# Altium project Slit_Lamp.PrjPcb (part 1 of 2)
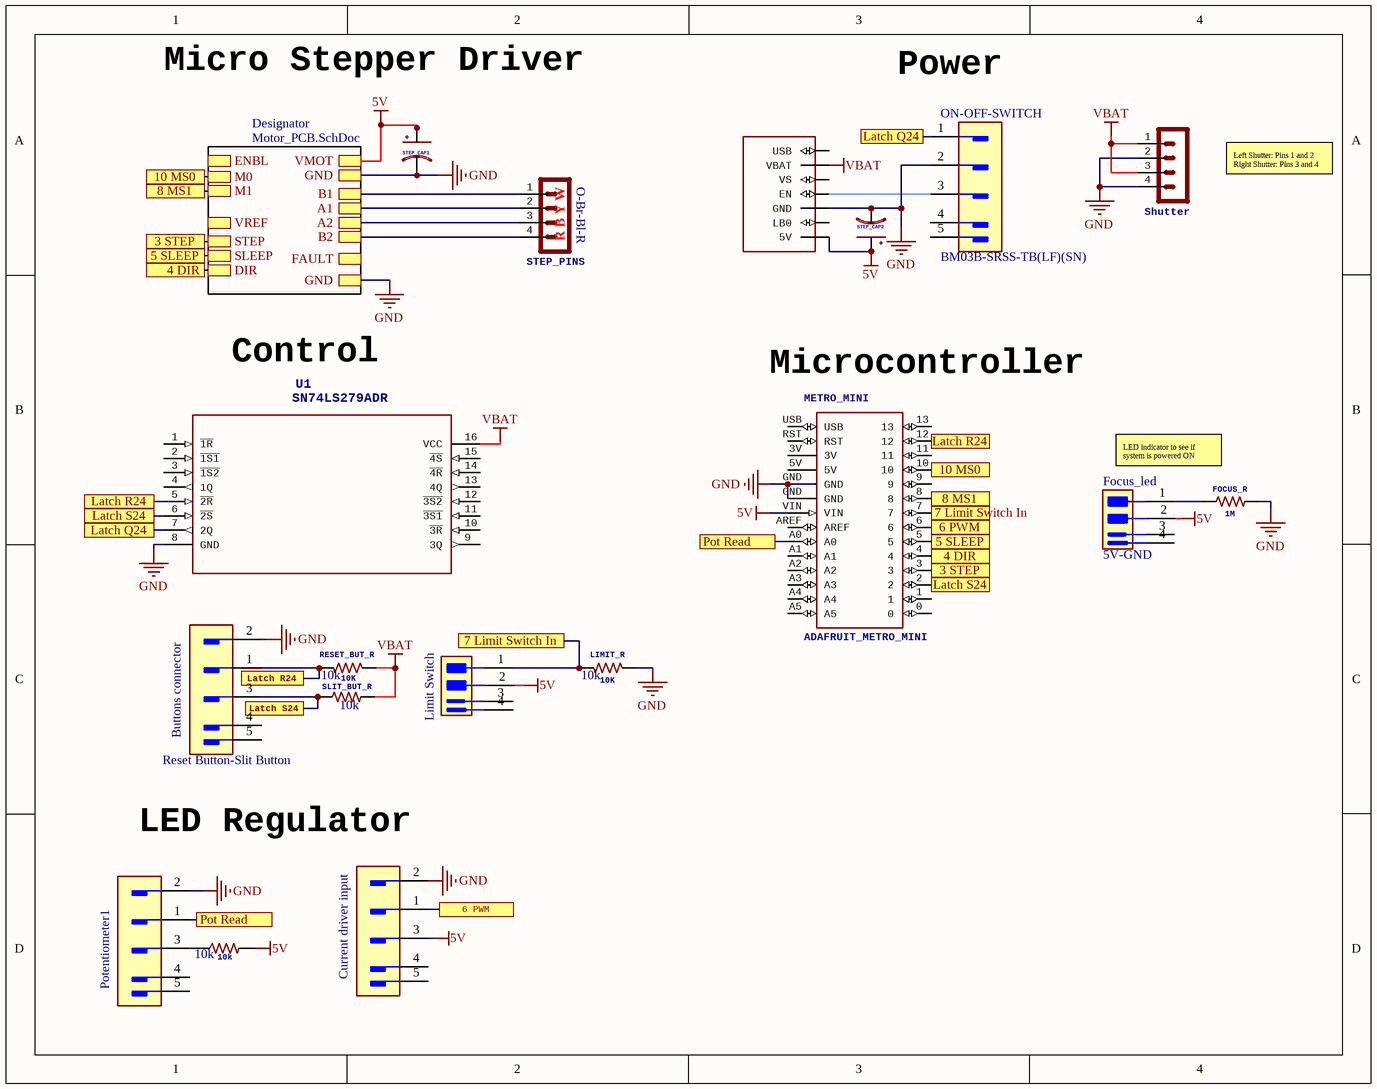
[diagram p0: Slit_Lamp_Schematic.SchDoc]
Title: Low Power Motor Driver (A4988)
2 sheets, 34 parts. Net scope: hierarchical (ports join the sheet entries above them; power ports are global).
Board file: V2_Slit_Lamp_PCB.PcbDoc
Sheets:
  Slit_Lamp_Schematic.SchDoc
    Designator = Motor_PCB.SchDoc

## Sheet Slit_Lamp_Schematic.SchDoc: Low Power Motor Driver (A4988)
size A

### Parts
10k  10K  [RES 0603_1608]
Buttons_connector  BM03B-SRSS-TB(LF)(SN): Reset Button-Slit Button  [JST BM03B-SRSS-TB]  (hidden comment: Conn_JST_BM03B-SRSS-TB_LF_SN_eec)
Current_driver_input  Conn_JST_BM03B-SRSS-TB_LF_SN_eec  [JST BM03B-SRSS-TB]  (value not drawn)
Focus_led  BM02B-SRSS-TB(LF)(SN): 5V-GND  [JST BM02B-SRSS-TB]  (hidden comment: JST BM02B-SRSS-TB(LF)(SN))
FOCUS_R  1M  [RES 0603_1608 RF]
LIMIT_R  10K  [RES 0603_1608]
Limit_Switch  JST BM02B-SRSS-TB(LF)(SN)  [JST BM02B-SRSS-TB]  (value not drawn)
METRO_MINI  ADAFRUIT_METRO_MINI  [ADAFRUIT_METRO_MINI]
ON-OFF-SWITCH  Part Number: BM03B-SRSS-TB(LF)(SN)  [JST BM03B-SRSS-TB]  (hidden comment: JST BM03B-SRSS-TB(LF)(SN))
Potentiometer1  Conn_JST_BM03B-SRSS-TB_LF_SN_eec  [JST BM03B-SRSS-TB]  (value not drawn)
POWER_1000C  ADAFRUIT_POWER_BOOST  [ADAFRUIT_POWER_BOOST_1000C]  (value not drawn)
RESET_BUT_R  10K  [RES 0603_1608]
Shutter  BM04B-SRSS  [JST BM04B-SRSS-TB]  (value not drawn)
SLIT_BUT_R  10K  [RES 0603_1608]
STEP_CAP1  Panasonic EEEFK1C101P  [Step_Capacitor]  (value not drawn)
STEP_CAP2  Panasonic EEEFK1C101P  [Step_Capacitor]  (value not drawn)
STEP_PINS  BM04B-SRSS  [JST BM04B-SRSS-TB]  (value not drawn)
U1  SN74LS279ADR  [D16-L]

### Sub-sheets
Designator = Motor_PCB.SchDoc: GND, GND, VMOT, B2, A1, B1, A2, FAULT, M0, M1, ENBL, VREF, STEP, SLEEP, DIR

### Ports
3 STEP, 4 DIR, 5 SLEEP, 6 PWM, 7 Limit Switch In, 8 MS1, 10 MS0, Latch Q24, Latch R24, Latch S24, Pot Read

### Nets
5V: 10k.2 Current_driver_input.3 Focus_led.2 Limit_Switch.2 METRO_MINI.VIN POWER_1000C.5V STEP_CAP1.A STEP_CAP2.A ; sheet Designator/VMOT
GND: Buttons_connector.2 Current_driver_input.2 FOCUS_R.2 LIMIT_R.1 METRO_MINI.GND ON-OFF-SWITCH.2 Potentiometer1.2 POWER_1000C.GND Shutter.2 Shutter.4 STEP_CAP1.K STEP_CAP2.K U1.8(GND) ; sheet Designator/GND, sheet Designator/GND
VBAT: POWER_1000C.VBAT RESET_BUT_R.1 Shutter.1 Shutter.3 SLIT_BUT_R.2 U1.16(VCC)
Net10k_1: 10k.1 Potentiometer1.3
NetButtons_connector_1: Buttons_connector.1 METRO_MINI.12 RESET_BUT_R.2 U1.5(~{2R}) ; port Latch R24
NetButtons_connector_3: Buttons_connector.3 METRO_MINI.2 SLIT_BUT_R.1 U1.6(~{2S}) ; port Latch S24
NetCurrent_driver_input_1: Current_driver_input.1 METRO_MINI.6 ; port 6 PWM
NetFocus_led_1: Focus_led.1 FOCUS_R.1
NetIC1_1: STEP_PINS.2 ; sheet Designator/A1
NetIC1_3: STEP_PINS.3 ; sheet Designator/A2
NetIC1_4: STEP_PINS.4 ; sheet Designator/B2
NetIC1_6: STEP_PINS.1 ; sheet Designator/B1
NetIC1_8: METRO_MINI.3 ; port 3 STEP, sheet Designator/STEP
NetIC1_9: METRO_MINI.4 ; port 4 DIR, sheet Designator/DIR
NetIC1_10: METRO_MINI.10 ; port 10 MS0, sheet Designator/M0
NetIC1_11: METRO_MINI.8 ; port 8 MS1, sheet Designator/M1
NetIC1_22: METRO_MINI.5 ; port 5 SLEEP, sheet Designator/SLEEP
NetLIMIT_R_2: LIMIT_R.2 Limit_Switch.1 METRO_MINI.7 ; port 7 Limit Switch In
NetMETRO_MINI_A0: METRO_MINI.A0 Potentiometer1.1 ; port Pot Read
NetON-OFF-SWITCH_1: ON-OFF-SWITCH.1 U1.7(2Q) ; port Latch Q24
NetON-OFF-SWITCH_3: ON-OFF-SWITCH.3 POWER_1000C.EN

Not connected (* = marked no-connect by the designer): Buttons_connector 4(MNT_1) 5(MNT_2); Current_driver_input 4(MNT_1) 5(MNT_2); Focus_led 3(MNT_1) 4(MNT_2); Limit_Switch 3(MNT_1) 4(MNT_2); METRO_MINI 0 1 3V 5V 9 11 13 A1 A2 A3 A4 A5 AREF RST USB; ON-OFF-SWITCH 4(MNT_1) 5(MNT_2); Potentiometer1 4(MNT_1) 5(MNT_2); POWER_1000C LB0 USB VS; U1 1(~{1R}) 2(~{1S1}) 3(~{1S2}) 4(1Q) 9(3Q) 10(~{3R}) 11(~{3S1}) 12(~{3S2}) 13(4Q) 14(~{4R}) 15(~{4S})

### Notes on the sheet
- Micro Stepper Driver
- (near ON-OFF-SWITCH) Power
- Left Shutter: Pins 1 and 2
  Right Shutter: Pins 3 and 4
- (near STEP_PINS) R B Y W
- (near STEP_PINS) O-Br-Bl-R
- Control
- (near METRO_MINI) Microcontroller
- LED indicator to see if system is powered ON
- LED Regulator

### Library data of the parts
10k LIMIT_R RESET_BUT_R SLIT_BUT_R = 10KΩ_SMD-0603_1/10W-5%: 10K resistor; Manufacturer: Yageo; MPN: RC0603JR-0710KL; GateName_1: G$1; DeviceSetName: 10KΩ; DIST: Digikey; DISTPN: 311-10KGRCT-ND; SymbolName_1: RESISTOR; DeviceName: _SMD-0603_1/10W-5%; LibraryName: PiB_resistors; DATASHEET: http://www.yageo.com/documents/recent/PYu-RC_Group_51_RoHS_L_9.pdf; DISTLINK: https://www.digikey.com/products/en?keywords=311-10KGRCT-ND; Value: 10k; Supplier 1: Digi-Key; Supplier Part Number 1: 541-10.0KHCT-ND; Supplier 2: Newark; Supplier Part Number 2: 61M5335
Buttons_connector Current_driver_input Potentiometer1 = Conn_JST_BM03B-SRSS-TB_LF_SN_eec: CONN 3 Positions Header, Shrouded Connector 0.039" (1.00mm) Surface Mount Tin; Manufacturer: JST; helpURL: https://upverter.com/upn/revision/3446d17d68d15384/; ComponentLink2Description: Datasheet; Temperature: -25°C to +85°C; Package: HDR03; Price: 0.389468695823; ComponentLink1URL: https://upverter.com/upn/revision/3446d17d68d15384/; ComponentLink1Description: Upverter; ComponentLink2URL: http://www.jst-mfg.com/product/pdf/eng/eSH.pdf; RoHS: TRUE; Temperature Range High: +85°C; Digikey Description: CONN 3 Positions Header, Shrouded Connector 0.039" (1.00mm) Surface Mount Tin; Digikey Part Number: 455-1789-1-ND; Lead Free: yes; Temperature Range Low: -25°C; Supplier 1: Digi-Key; Supplier Part Number 1: 455-1789-1-ND; Supplier 2: Arrow; Supplier Part Number 2: BM03B-SRSS-TB(LF)(SN)
Focus_led Limit_Switch = Conn_JST_BM02B-SRSS-TB_LF_SN_eec: CONN 2 Positions Header, Shrouded Connector 0.039" (1.00mm) Surface Mount Tin; helpURL: https://upverter.com/upn/revision/b9c6bdbe462de3ee/; ComponentLink2Description: Datasheet; Temperature: -25°C to +85°C; Package: HDR02; Price: 0.331432050191; ComponentLink1URL: https://upverter.com/upn/revision/b9c6bdbe462de3ee/; Manufacturer: JST; ComponentLink1Description: Upverter; ComponentLink2URL: http://www.jst-mfg.com/product/pdf/eng/eSH.pdf; RoHS: TRUE; Temperature Range High: +85°C; Digikey Description: CONN 2 Positions Header, Shrouded Connector 0.039" (1.00mm) Surface Mount Tin; Digikey Part Number: 455-1788-1-ND; Lead Free: yes; Temperature Range Low: -25°C; Supplier 1: Digi-Key; Supplier Part Number 1: 455-1788-1-ND
  Focus_led: Supplier 2: Arrow; Supplier Part Number 2: BM02B-SRSS-TB(LF)(SN)
  Limit_Switch: Part Number: BM02B-SRSS-TB(LF)(SN); Supplier 2: Digi-Key; Supplier Part Number 2: 455-1788-6-ND
FOCUS_R = RESISTOR_PTH-0207/7_1/8W-5%: Fixed Resistor, Metal Glaze/thick Film, 0.1W, 1000000ohm, 75V, 1% +/-Tol, 100ppm/Cel, Surface Mount, 0603; Manufacturer: Panasonic; GateName_1: G$1; TESTED: YES; Value: 1Meg; Resistance: 1MR; Temperature Coefficient: 100ppm/°C; Power Rating: 100mW; SymbolName_1: RESISTOR; DeviceName: _PTH-0207/7_1/8W-5%; LibraryName: PiB_resistors; DeviceSetName: RESISTOR; CREATOR: MrSwirlyEyes; Manufacturer 3: Panasonic; Manufacturer Part Number 3: ERJ-3EKF1004V; RoHS: Yes; Category: Chip SMD Resistors; Mount: Surface Mount; Case/Package: 0603; Number of Pins: 2; Contact Plating: Tin; Case Code (Imperial): 0603; Case Code (Metric): 1608; Min Operating Temperature: -55°C; Max Operating Temperature: 155°C; Tolerance: 1%; Composition: Thick Film; Packaging: Tape and Reel; Voltage Rating: 75V; Package Quantity: 1; Termination: SMD/SMT; Number of Terminations: 2; Military Standard: Not; Max Power Dissipation: 100mW; Voltage Rating (DC): 75V; Features: Automotive AEC-Q200; Length: 1.6mm; Height: 0.022inch; Width: 0.8mm; Depth: 0.8mm; Radiation Hardening: No; REACH SVHC: No SVHC; Lead Free: Lead Free; ComponentLink1URL: https://datasheet.ciiva.com:443/pdfs/VipMasterIC/IC/PANA/PANA-S-A0009889626/PANA-S-A0009889626-1.pdf?src-supplier=IHS+Markit; ComponentLink1Description: https://datasheet.ciiva.com:443/pdfs/VipMasterIC/IC/PANA/PANA-S-A0009889626/PANA-S-A0009889626-1.pdf?src-supplier=IHS+Markit; ComponentLink2URL: https://datasheet.ciiva.com/2432/aoa0000c304-2432473.pdf?src-supplier=Digi-Key; ComponentLink2Description: https://datasheet.ciiva.com/2432/aoa0000c304-2432473.pdf?src-supplier=Digi-Key; Supplier 1: Digi-Key; Supplier Part Number 1: P1.00MHCT-ND; Supplier 2: Newark; Supplier Part Number 2: 85Y8504
METRO_MINI = ADAFRUIT_METRO_MINI: GateName_1: G$1; SymbolName_1: ADAFRUIT_METRO_MINI; LibraryName: adafruit_metro_mini; DeviceSetName: ADAFRUIT_METRO_MINI; Package: ADAFRUIT_METRO_MINI
ON-OFF-SWITCH = Conn_JST_BM03B-SRSS-TB_LF_SN_eec: CONN 3 Positions Header, Shrouded Connector 0.039" (1.00mm) Surface Mount Tin; helpURL: https://upverter.com/upn/revision/3446d17d68d15384/; ComponentLink2Description: Datasheet; Temperature: -25°C to +85°C; Package: HDR03; Price: 0.389468695823; ComponentLink1URL: https://upverter.com/upn/revision/3446d17d68d15384/; Manufacturer: JST; ComponentLink1Description: Upverter; ComponentLink2URL: http://www.jst-mfg.com/product/pdf/eng/eSH.pdf; RoHS: TRUE; Temperature Range High: +85°C; Digikey Description: CONN 3 Positions Header, Shrouded Connector 0.039" (1.00mm) Surface Mount Tin; Digikey Part Number: 455-1789-1-ND; Lead Free: yes; Temperature Range Low: -25°C; Supplier 1: Digi-Key; Supplier Part Number 1: 455-1789-1-ND; Supplier 2: Arrow; Supplier Part Number 2: BM03B-SRSS-TB(LF)(SN)
POWER_1000C = ADAFRUIT_POWER_BOOST: GateName_1: G$1; SymbolName_1: ADAFRUIT_POWER_BOOST; LibraryName: adafruit_power_1000c; DeviceSetName: ADAFRUIT_POWER_BOOST; Package: ADAFRUIT_POWER_BOOST_1000C
Shutter STEP_PINS = BM04B-SRSS-TB: JST SH series header 1.00mm pitch disconnectable crimp style connectors, vertical (side entry type), 4 pins; Manufacturer Part Number 1: BM04B-SRSS-TB(LF)(SN); GateName_1: G$1; SymbolName_1: M_1R04; DeviceName: -TB; Connector Type: Male Pin; Number of Positions: 4; Current Rating: 1A; Insulation Resistance: 100MR; Max Voltage Rating (AC): 50V; Gender: Male; Contact Resistance: 40mR; Pitch: 0.039inch; LibraryName: con-JST SH; DeviceSetName: BM04B-SRSS; Manufacturer 1: JST; Stock 1: 5100; Pricing 1: 1=0.630000, 10=0.592000, 100=0.454000, 500=0.394800 (USD); RoHS: Yes; Mount: Surface Mount; Contact Plating: Tin,Lead,Copper; Color: Natural; Contact Material: Copper Alloy; Housing Material: Polyamide; Housing Color: Beige; Material: Polyamide; Min Operating Temperature: -25°C; Max Operating Temperature: 85°C; Termination: Solder; Number of Rows: 1; Packaging: Tape and Reel; Orientation: Straight; Number of Contacts: 4; Max Voltage Rating (DC): 50V; Voltage Rating (AC): 50V; Max Current Rating: 1A; Length: 6mm; Depth: 2.9mm; Lead Pitch: 1mm; Lead Free: Lead Free; Flammability Rating: UL94 V-0; REACH SVHC: No SVHC; ComponentLink1URL: https://datasheet.ciiva.com/26894/getdatasheetpartid-690899-26894827.pdf?src-supplier=Verical; ComponentLink1Description: https://datasheet.ciiva.com/26894/getdatasheetpartid-690899-26894827.pdf?src-supplier=Verical; ComponentLink2URL: https://datasheet.ciiva.com/26924/getdatasheetpartid-708793-26924043.pdf?src-supplier=Verical; ComponentLink2Description: https://datasheet.ciiva.com/26924/getdatasheetpartid-708793-26924043.pdf?src-supplier=Verical; ComponentLink3URL: https://datasheet.ciiva.com/16211/esr-16211085.pdf?src-supplier=Future+Electronics; ComponentLink3Description: https://datasheet.ciiva.com/16211/esr-16211085.pdf?src-supplier=Future+Electronics; Supplier 1: Digi-Key; Supplier Part Number 1: 455-1790-1-ND; Supplier 2: Arrow; Supplier Part Number 2: BM04B-SRSS-TB (LF)(SN)
STEP_CAP1 STEP_CAP2 = 100UF-POLARIZED_SMD_16V-20%_L6.6-W6.6: 100uF/ 16V; Manufacturer: Panasonic Electronic Components; MPN: EEE-FK1C101P; GateName_1: G$1; SymbolName_1: CAPACITOR_POLARIZED; DIST: Digikey; DISTPN: PCE3783CT-ND; TESTED: NO; Dielectric Material: Aluminium; Capacitance: 100uF; Tolerance: 20%; Leakage Current: 3uA; Polarity: Polar; Ripple Current: 240mA; ESR (Equivalent Series Resistance): 360mR; Life (Hours): 2000Hour; DeviceName: _SMD_16V-20%_L6.6-W6.6; LibraryName: PiB_capacitors; DeviceSetName: 100UF-POLARIZED; +: +; CREATOR: MrSwirlyEyes; DATASHEET: http://industrial.panasonic.com/www-cgi/jvcr13pz.cgi?E+PZ+3+ABA0120+EEEFK1C101P+7+WW; DISTLINK: https://www.digikey.com/products/en?keywords=PCE3783CT-ND; RoHS: Yes; Mount: Surface Mount,PCB; Case/Package: Radial; Number of Pins: 2; Material: Aluminium; Min Operating Temperature: -55°C; Max Operating Temperature: 105°C; Packaging: Tape and Reel; Voltage Rating (DC): 16V; Voltage Rating: 16V; Termination: SMD/SMT; Package Quantity: 1000; Voltage: 16V; Ripple Current (AC): 240mA; Impedance: 360mR; Diameter: 6.3mm; Length: 5.8mm; Height: 5.8mm; Height - Seated (Max): 0.24inch; Radiation Hardening: No; REACH SVHC: No SVHC; ComponentLink1URL: https://datasheet.ciiva.com/19479/1357482-19479360.pdf?src-supplier=Jameco; ComponentLink1Description: https://datasheet.ciiva.com/19479/1357482-19479360.pdf?src-supplier=Jameco; ComponentLink2URL: https://datasheet.ciiva.com/11777/0900766b80e4e8b0-11777237.pdf?src-supplier=RSComponents; ComponentLink2Description: https://datasheet.ciiva.com/11777/0900766b80e4e8b0-11777237.pdf?src-supplier=RSComponents; ComponentLink3URL: https://datasheet.ciiva.com/29313/443464-da-01-en-smd-elko-vfk-d-100-uf-16v-29313488.pdf?src-supplier=Conrad; ComponentLink3Description: https://datasheet.ciiva.com/29313/443464-da-01-en-smd-elko-vfk-d-100-uf-16v-29313488.pdf?src-supplier=Conrad; ComponentLink4URL: https://datasheet.ciiva.com/2983/aba0000ce120-2983939.pdf?src-supplier=Avnet; ComponentLink4Description: https://datasheet.ciiva.com/2983/aba0000ce120-2983939.pdf?src-supplier=Avnet; ComponentLink5URL: https://datasheet.ciiva.com/43463/58258-43463495.pdf?src-supplier=Farnell; ComponentLink5Description: https://datasheet.ciiva.com/43463/58258-43463495.pdf?src-supplier=Farnell; ComponentLink6URL: https://datasheet.ciiva.com/46376/1676921-46376425.pdf?src-supplier=Element14; ComponentLink6Description: https://datasheet.ciiva.com/46376/1676921-46376425.pdf?src-supplier=Element14; ComponentLink7URL: https://datasheet.ciiva.com/24022/aba0000ce120-24022554.pdf?src-supplier=Mouser; ComponentLink7Description: https://datasheet.ciiva.com/24022/aba0000ce120-24022554.pdf?src-supplier=Mouser; ComponentLink8URL: https://datasheet.ciiva.com/16539/aba0000ce120-16539980.pdf?src-supplier=Avnet+Asia; ComponentLink8Description: https://datasheet.ciiva.com/16539/aba0000ce120-16539980.pdf?src-supplier=Avnet+Asia; ComponentLink9URL: https://datasheet.ciiva.com/25899/aba0000ce120-25899324.pdf?src-supplier=Avnet+Europe; ComponentLink9Description: https://datasheet.ciiva.com/25899/aba0000ce120-25899324.pdf?src-supplier=Avnet+Europe; ComponentLink10URL: https://datasheet.ciiva.com/30177/aba0000ce120-30177788.pdf?src-supplier=Onlinecomponents.com; ComponentLink10Description: https://datasheet.ciiva.com/30177/aba0000ce120-30177788.pdf?src-supplier=Onlinecomponents.com; ComponentLink11URL: https://datasheet.ciiva.com/14601/70255214-14601005.pdf?src-supplier=Allied+Electronics; ComponentLink11Description: https://datasheet.ciiva.com/14601/70255214-14601005.pdf?src-supplier=Allied+Electronics; ComponentLink12URL: https://datasheet.ciiva.com/16449/aba0000ce120-16449534.pdf?src-supplier=Future+Electronics; ComponentLink12Description: https://datasheet.ciiva.com/16449/aba0000ce120-16449534.pdf?src-supplier=Future+Electronics; ComponentLink13URL: https://datasheet.ciiva.com/46387/1676921-46387918.pdf?src-supplier=Element14; ComponentLink13Description: https://datasheet.ciiva.com/46387/1676921-46387918.pdf?src-supplier=Element14; Supplier 1: Digi-Key; Supplier Part Number 1: PCE3783CT-ND; Supplier 2: Arrow; Supplier Part Number 2: EEEFK1C101P
U1 = SN74LS279ADR: SR Latch; MANUFACTURER: Texas Instruments; GateName_1: A; SymbolName_1: SN74LS279A_D_16; BUILT_BY: EMA_UL_Team; LibraryName: SRlatch; DeviceSetName: SN74LS279ADR; MANUFACTURER_PART_NUMBER: SN74LS279ADR; VENDOR: Vendor; Supplier 1: Digi-Key; Supplier Part Number 1: 296-29449-1-ND; Supplier 2: Mouser; Supplier Part Number 2: 595-SN74LS279ADR